# EAGLE design IR_blinker (EAGLE 9.6.2)
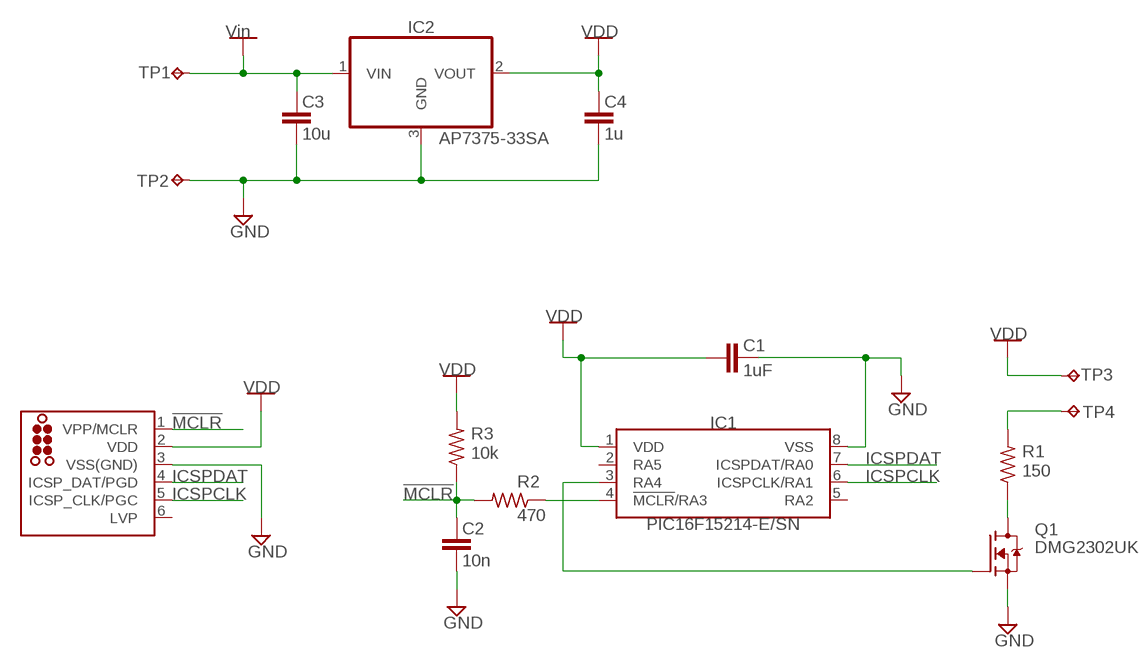
[diagram p0: schematic, sheet 1]

## Parts
C1  1uF  C-EUC0603  [C0603]
C2  10n  C-EUC0603  [C0603]
C3  10u  C-EUC0603  [C0603]
C4  1u  C-EUC0603  [C0603]
IC1  PIC16F15214-E/SN  [SOIC-8]
IC2  AP7375-33SA  [SOT23]
J1  TC2030-MCP-NL  [TC2030-MCP-NL]
Q1  DMG2302UK  [SOT23]
R1  150  R-US_R0603  [R0603]
R2  470  R-US_R0603  [R0603]
R3  10k  R-US_R0603  [R0603]
TP1  TPTP20SQ  [TP20SQ]
TP2  TPTP20SQ  [TP20SQ]
TP3  TPTP20SQ  [TP20SQ]
TP4  TPTP20SQ  [TP20SQ]

## Nets
!MCLR: C2.2 J1.1(VPP/MCLR) R2.2 R3.1
GND: C1.2 C2.1 C3.1 C4.1 IC1.8(VSS) IC2.3(GND) J1.3(VSS(GND)) Q1.2(S) TP2.TP
ICSPCLK: IC1.6(ICSPCLK/RA1) J1.5(ICSP_CLK/PGC)
ICSPDAT: IC1.7(ICSPDAT/RA0) J1.4(ICSP_DAT/PGD)
LED_RETURN: R1.2 TP4.TP
N$1: Q1.3(D) R1.1
N$3: IC1.3(RA4) Q1.1(G)
N$5: IC1.4(!MCLR!/RA3) R2.1
VDD: C1.1 C4.2 IC1.1(VDD) IC2.2(VOUT) J1.2(VDD) R3.2 TP3.TP
VIN: C3.2 IC2.1(VIN) TP1.TP ; supply symbol labelled Vin
Unconnected: IC1.2(RA5) IC1.5(RA2) J1.6(LVP)

## Library data of the parts
C1-C4 = rcl:C-EU: CAPACITOR, European symbol; SPICEPREFIX: C
IC1 = PIC16F:PIC16F15214: PIC PIC® 16F, Functional Safety (FuSa) Microcontroller IC 8-Bit 32MHz 7KB (4K x 14) FLASH 8-SOIC https://ww1.microchip.com/downloads/aemDocuments/documents/MCU08/ProductDocuments/DataSheets/PIC16F15213-14-23-24-43-44-Microcontroller-Data-Sheet-40002195.pdf
IC2 = Diodes_Inc:AP7375-33: Linear Voltage Regulator IC Positive Fixed 1 Output 300mA 3.3V https://www.diodes.com/assets/Datasheets/AP7375.pdf
J1 = tag_connect:TC2030: TAG-CONNECT ICSP Connector Manufacturer: Tag-Connect <http://www.tag-connect.com> Cable for easy In-Circuit Serial Programming. Designed for Microchip ICD2, suitable for many others. Two variants - one "with legs" (for hands-free fit on PCB) and another "without legs" for quick programming. PAD Description 1 MCLR/Vpp 2 Vdd 3 GND 4 PGD (ISPDAT) 5 PGC (ISPCLK) 6 nc (used for LVP) ©2009 ROFA.cz - modified and updated by Robert Darlington ‹rdarlington@gmail.com›
Q1 = Diodes_Inc:DMG2302UK: N-Channel 20 V 2.8A (Ta) 660mW (Ta) Surface Mount SOT-23-3 https://www.diodes.com/assets/Datasheets/DMG2302UK.pdf
R1-R3 = rcl:R-US_: RESISTOR, American symbol; SPICEPREFIX: R
TP1-TP4 = testpad:TP: Test pad

## Board
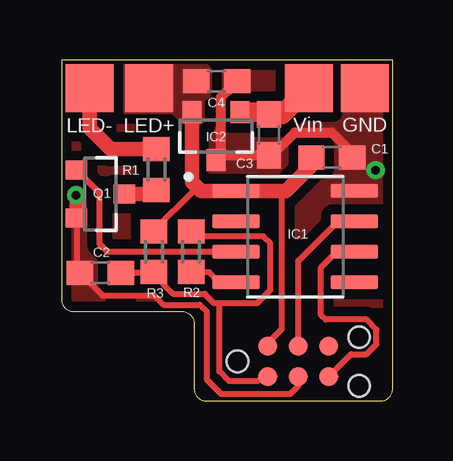
[diagram p1: board, top side]
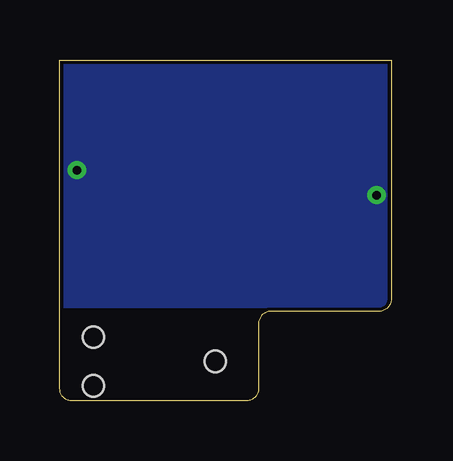
[diagram p2: board, bottom side, seen from below]

Size 13.82 x 14.22 mm. Coordinates in mm from the lower left corner, seen from the top.
Outline: 0.51,3.73 5.03,3.73 arc-90 5.54,3.23 5.54,0.51 arc90 6.05,0 13.31,0 arc90 13.82,0.51 13.82,14.22 0,14.22 0,4.24 arc90 0.51,3.73
Copper layers (1*16): Top 0.035mm / dielectric 1.5mm / Bottom 0.035mm
Design rules "default *": minimum track width 6mil, minimum drill 0.35mm, track to track 8mil, track to pad 8mil, pad to pad 8mil, via to via 8mil, smd to smd 0mil, copper to edge 6mil, drill to drill 6mil, minimum pad ring 10mil, minimum via ring 8mil, stop-mask expansion 4mil, vias tented up to drill 0mil, thermal gap 10mil

### Footprints (pad centres in the part's own frame; a part is rotated, then mirrored left to right if it is on the bottom)
C0603 = smd 1.1 x 1: 1 -0.85,0; 2 0.85,0
SOIC-8 = smd 1.98 x 0.59: 1 -2.47,1.905; 2 -2.47,0.635; 3 -2.47,-0.635; 4 -2.47,-1.905; 5 2.47,-1.905; 6 2.47,-0.635; 7 2.47,0.635; 8 2.47,1.905
SOT23 = smd 0.8 x 0.9: 1 -1,-1; 2 1,-1; 3 0,1
TC2030-MCP-NL = smd 0.787 x 0.787: 1 1.27,-0.635; 2 1.27,0.635; 3 2.54,-0.635; 4 2.54,0.635; 5 3.81,-0.635; 6 3.81,0.635 | hole 0.889: 0,0; 5.08,-1.016; 5.08,1.016
R0603 = smd 1 x 1.1: 1 -0.85,0; 2 0.85,0
TP20SQ = smd 2 x 2: TP 0,0

### Placement (x,y rotation side)
C1  11.28,10.16 0 top
C2  1.63,5.33 0 top
C3  8.66,11.1 90 top
C4  6.48,13.34 180 top
IC1  9.75,6.86 0 top
IC2  6.45,11.05 180 top
J1  7.34,1.65 0 top
Q1  1.63,8.64 270 top
R1  3.96,9.65 90 top
R2  5.41,6.22 90 top
R3  3.86,6.22 90 top
TP1  10.31,13.06 0 top
TP2  12.65,13.06 0 top
TP3  3.66,13.06 0 top
TP4  1.17,13.06 0 top

### Tracks (layer width: path | path; a pad name or v marks a point on that pad's centre or on a via)
!MCLR
  Top 0.254: J1.1 8.38,1.02 8.19,0.83 7,0.83 6.59,1.23 6.59,4.08 | R2.2 5.56,7.07 5.76,6.87 8.42,6.87 8.71,6.58 8.71,4.62 8.17,4.08 6.59,4.08 | C2.2 3.82,5.33 R3.1 3.86,5.27 4.66,4.47 5.97,4.47 6.36,4.08 6.59,4.08
GND  (via drill 0.35)
  Top 0.254: J1.3 9.88,0.64 9.52,0.28 6.68,0.28 6.05,0.91 6.05,3.72 5.77,4.01 4.26,4.01 3.88,4.39 1.72,4.39 C2.1 0.63,5.48 Q1.2
  Top 0.406: C4.1 6.9,12.9 6.88,12.9 6.64,12.66 6.64,10.24 IC2.3 6.65,10.25 C3.1 8.79,10.25 9.73,11.19 11.27,11.19 12.13,10.34 C1.2
  Top 0.61: v0.61,8.59 0.63,8.57 Q1.2
  other vias: 13.11,9.63
  pour Bottom (rank 2): -0.03,14.1 13.82,14.1 13.82,4.01 0.1,4.01
  pour Top (isolate 0.406, rank 6, no thermals): 0.1,4.06 0.1,14.22 13.82,14.22 13.82,4.06
ICSPCLK
  Top 0.254: IC1.6 11.48,6.22 10.83,5.58 10.83,3.59 11.02,3.39 12.72,3.39 13.14,2.97 13.14,2.37 12.72,1.94 12.08,1.94 J1.5
ICSPDAT
  Top 0.254: J1.4 9.88,5.84 11.53,7.49 IC1.7
LED_RETURN
  Top 0.61: R1.2 2.05,10.5 1.17,11.38 TP4.TP
  Top 0.813: 0.75,12.64 TP4.TP
N$1
  Top 0.61: Q1.3 3.96,8.64 R1.1
N$3
  Top 0.254: Q1.1 1.59,8.67 1.59,6.55 1.92,6.22 IC1.3
N$5
  Top 0.254: R2.1 6.16,5.37 6.58,4.95 IC1.4
VDD
  Top 0.254: 8.61,2.41 9.19,3 9.19,8.59 9.37,8.76 | 3.86,7.12 5.5,8.76 6.2,8.76
  Top 0.406: J1.2 8.61,2.41 | R3.2 3.86,7.12
  Top 0.61: C1.1 10.43,9.82 9.37,8.76 IC1.1 6.2,8.76 5.82,8.76 5.45,9.13 IC2.2
  pour Top (no thermals): 5.18,11.68 5.05,11.68 4.67,12.06 2.69,12.06 2.69,14.02 5.94,14.02 6.15,13.82 6.15,12.83 5.84,12.52 5.84,11.66 5.16,11.66
VIN
  Top 0.813: IC2.1 8.56,12.05 C3.2 9.21,11.95 TP1.TP

### Text on the board
tNames: LED- | LED+ | Vin | GND